# EAGLE design schaltplan_matrix2 (EAGLE 8.5.0)
blub
DRAWING_NAME: Matrix Schaltplan; LAST_DATE_TIME: 18.11.2013
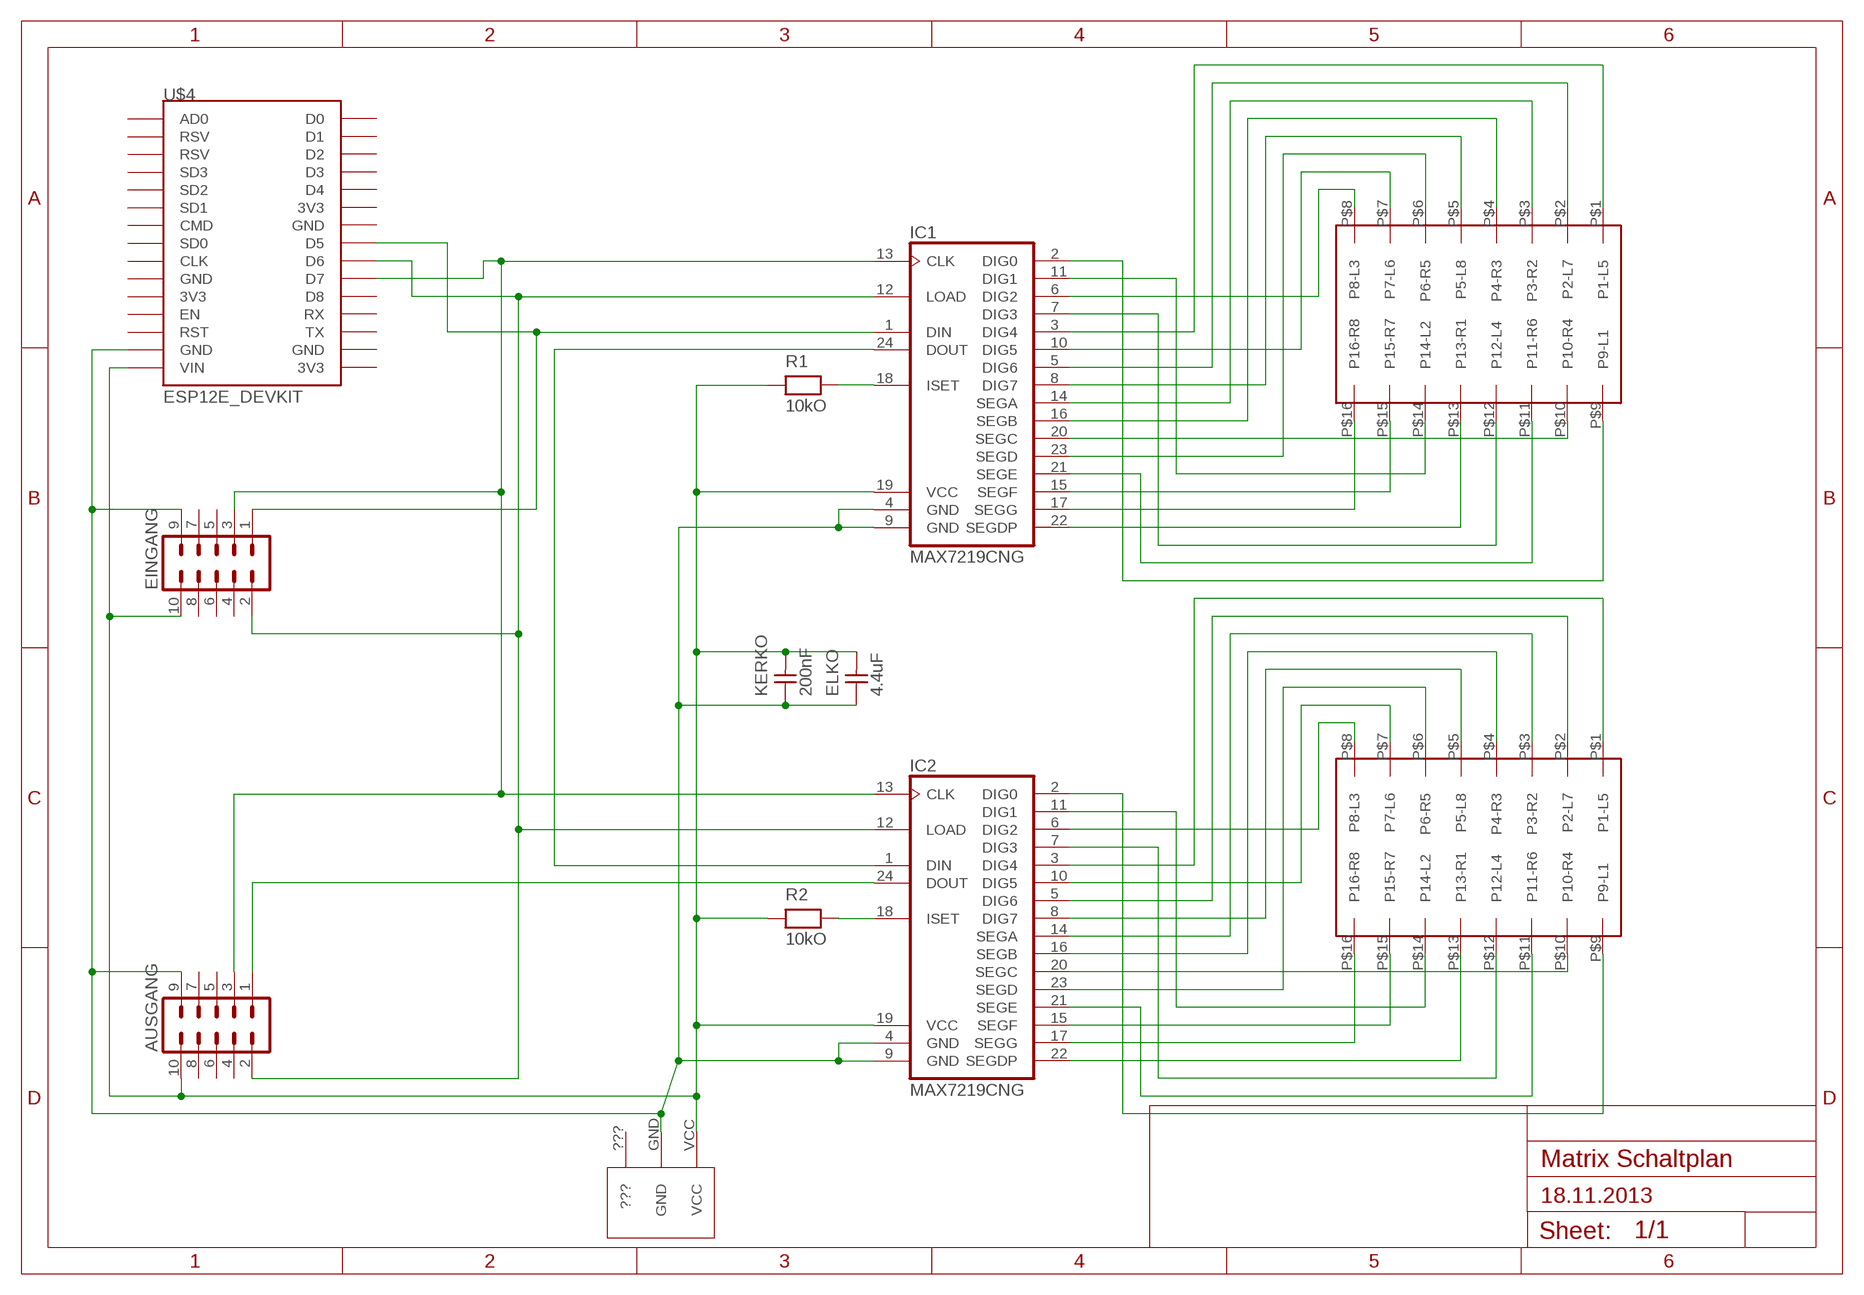
[diagram p0: schematic, sheet 1]

## Parts
AUSGANG  ML10  [ML10]
EINGANG  ML10  [ML10]
ELKO  4.4uF  CAPNP-5  [C-5]
IC1  MAX7219CNG  [DIL24-3]
IC2  MAX7219CNG  [DIL24-3]
KERKO  200nF  CAPNP-5  [C-5]
R1  10kO  RESEU-5  [R-5]
R2  10kO  RESEU-5  [R-5]
U$1  MATRIX  [MATRIX]
U$2  MATRIX  [MATRIX]
U$3  LUM1613-18  [LUM16113-18]
U$4  ESP12E_DEVKIT  [ESP12E_DEVKIT]

## Nets
N$1: IC1.20(SEGC) U$1.P$10(P10-R4)
N$2: IC1.21(SEGE) U$1.P$11(P11-R6)
N$3: IC2.22(SEGDP) U$2.P$13(P13-R1)
N$4: IC2.14(SEGA) U$2.P$3(P3-R2)
N$5: IC2.16(SEGB) U$2.P$4(P4-R3)
N$6: IC2.23(SEGD) U$2.P$6(P6-R5)
N$7: IC1.11(DIG1) U$1.P$14(P14-L2)
N$8: IC2.15(SEGF) U$2.P$15(P15-R7)
N$9: IC1.22(SEGDP) U$1.P$13(P13-R1)
N$10: IC1.6(DIG2) U$1.P$8(P8-L3)
N$11: IC1.7(DIG3) U$1.P$12(P12-L4)
N$12: IC1.14(SEGA) U$1.P$3(P3-R2)
N$13: IC1.16(SEGB) U$1.P$4(P4-R3)
N$14: IC1.2(DIG0) U$1.P$9(P9-L1)
N$15: IC1.23(SEGD) U$1.P$6(P6-R5)
N$16: IC2.17(SEGG) U$2.P$16(P16-R8)
N$17: IC1.15(SEGF) U$1.P$15(P15-R7)
N$18: IC1.17(SEGG) U$1.P$16(P16-R8)
N$19: IC1.3(DIG4) U$1.P$1(P1-L5)
N$20: IC1.10(DIG5) U$1.P$7(P7-L6)
N$21: IC2.11(DIG1) U$2.P$14(P14-L2)
N$22: IC1.5(DIG6) U$1.P$2(P2-L7)
N$23: IC1.8(DIG7) U$1.P$5(P5-L8)
N$24: IC2.6(DIG2) U$2.P$8(P8-L3)
N$25: IC2.7(DIG3) U$2.P$12(P12-L4)
N$26: IC2.3(DIG4) U$2.P$1(P1-L5)
N$27: IC2.10(DIG5) U$2.P$7(P7-L6)
N$28: IC2.5(DIG6) U$2.P$2(P2-L7)
N$29: IC2.8(DIG7) U$2.P$5(P5-L8)
N$30: IC2.21(SEGE) U$2.P$11(P11-R6)
N$31: IC2.20(SEGC) U$2.P$10(P10-R4)
N$32: IC2.2(DIG0) U$2.P$9(P9-L1)
N$33: EINGANG.1 IC1.1(DIN) U$4.D5
N$34: AUSGANG.3 EINGANG.3 IC1.13(CLK) IC2.13(CLK) U$4.D7
N$35: IC1.24(DOUT) IC2.1(DIN)
N$36: AUSGANG.2 EINGANG.2 IC1.12(LOAD) IC2.12(LOAD) U$4.D6
N$37 [power]: IC1.18(ISET) R1.2
N$38 [power]: IC2.18(ISET) R2.2
N$39: AUSGANG.10 EINGANG.10 ELKO.2 IC1.19(VCC) IC2.19(VCC) KERKO.2 R1.1 R2.1 U$3.VCC U$4.VIN
N$42: AUSGANG.1 IC2.24(DOUT)
N$43: AUSGANG.9 EINGANG.9 ELKO.1 IC1.4(GND) IC1.9(GND) IC2.4(GND) IC2.9(GND) KERKO.1 U$3.GND U$4.GND@1(GND)
Unconnected: AUSGANG.4 AUSGANG.5 AUSGANG.6 AUSGANG.7 AUSGANG.8 EINGANG.4 EINGANG.5 EINGANG.6 EINGANG.7 EINGANG.8 U$4.3V3@0(3V3) U$4.3V3@1(3V3) U$4.3V3@2(3V3) U$4.AD0 U$4.CLK U$4.CMD U$4.D0 U$4.D1 U$4.D2 U$4.D3 U$4.D4 U$4.D8 U$4.EN U$4.GND@0(GND) U$4.GND@2(GND) U$4.GND@3(GND) U$4.RST U$4.RSV@0(RSV) U$4.RSV@1(RSV) U$4.RX U$4.SD0 U$4.SD1 U$4.SD2 U$4.SD3 U$4.TX

## Power pins joined to a net without a drawn wire
???: U$3.???

## Library data of the parts
AUSGANG EINGANG = con-harting-ml:ML10: HARTING; OC_FARNELL: unknown; OC_NEWARK: unknown
ELKO KERKO = discrete-standart:CAPNP-5
IC1 IC2 = maxim:MAX7219CNG: LED DISPLAY DRIVER; MF: MAXIM; MPN: MAX7219CNG; OC_FARNELL: 1523914; OC_NEWARK: 34C4018
R1 R2 = discrete-standart:RESEU-5
U$1 U$2 = matrix:MATRIX: Erstellt von Sören Timm
U$3 = Eagle_Library:LUM1613-18
U$4 = ESP12E_DEVKIT:ESP12E_DEVKIT: ESP12E DEVKIT BOARD

## Net classes
0 default: width 0.406 mm, clearance 0.66 mm
1 power: width 0.61 mm, clearance 0.66 mm

## Board
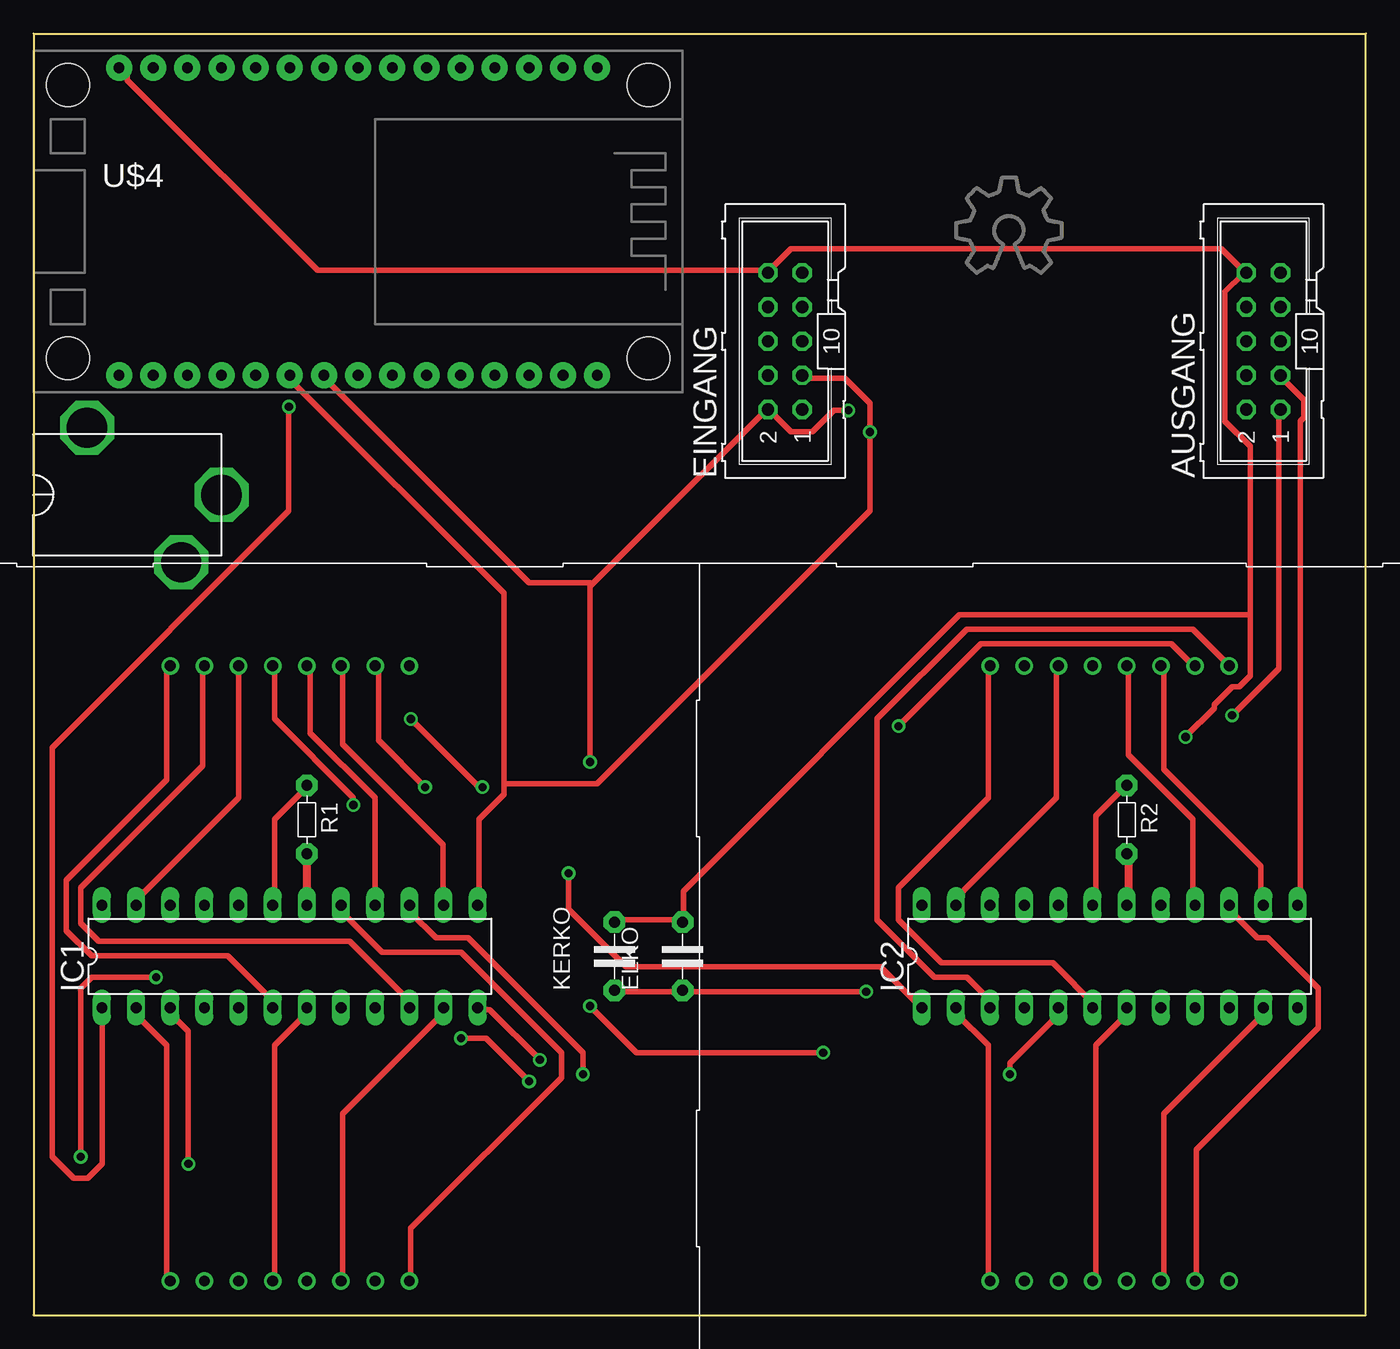
[diagram p1: board, top side]
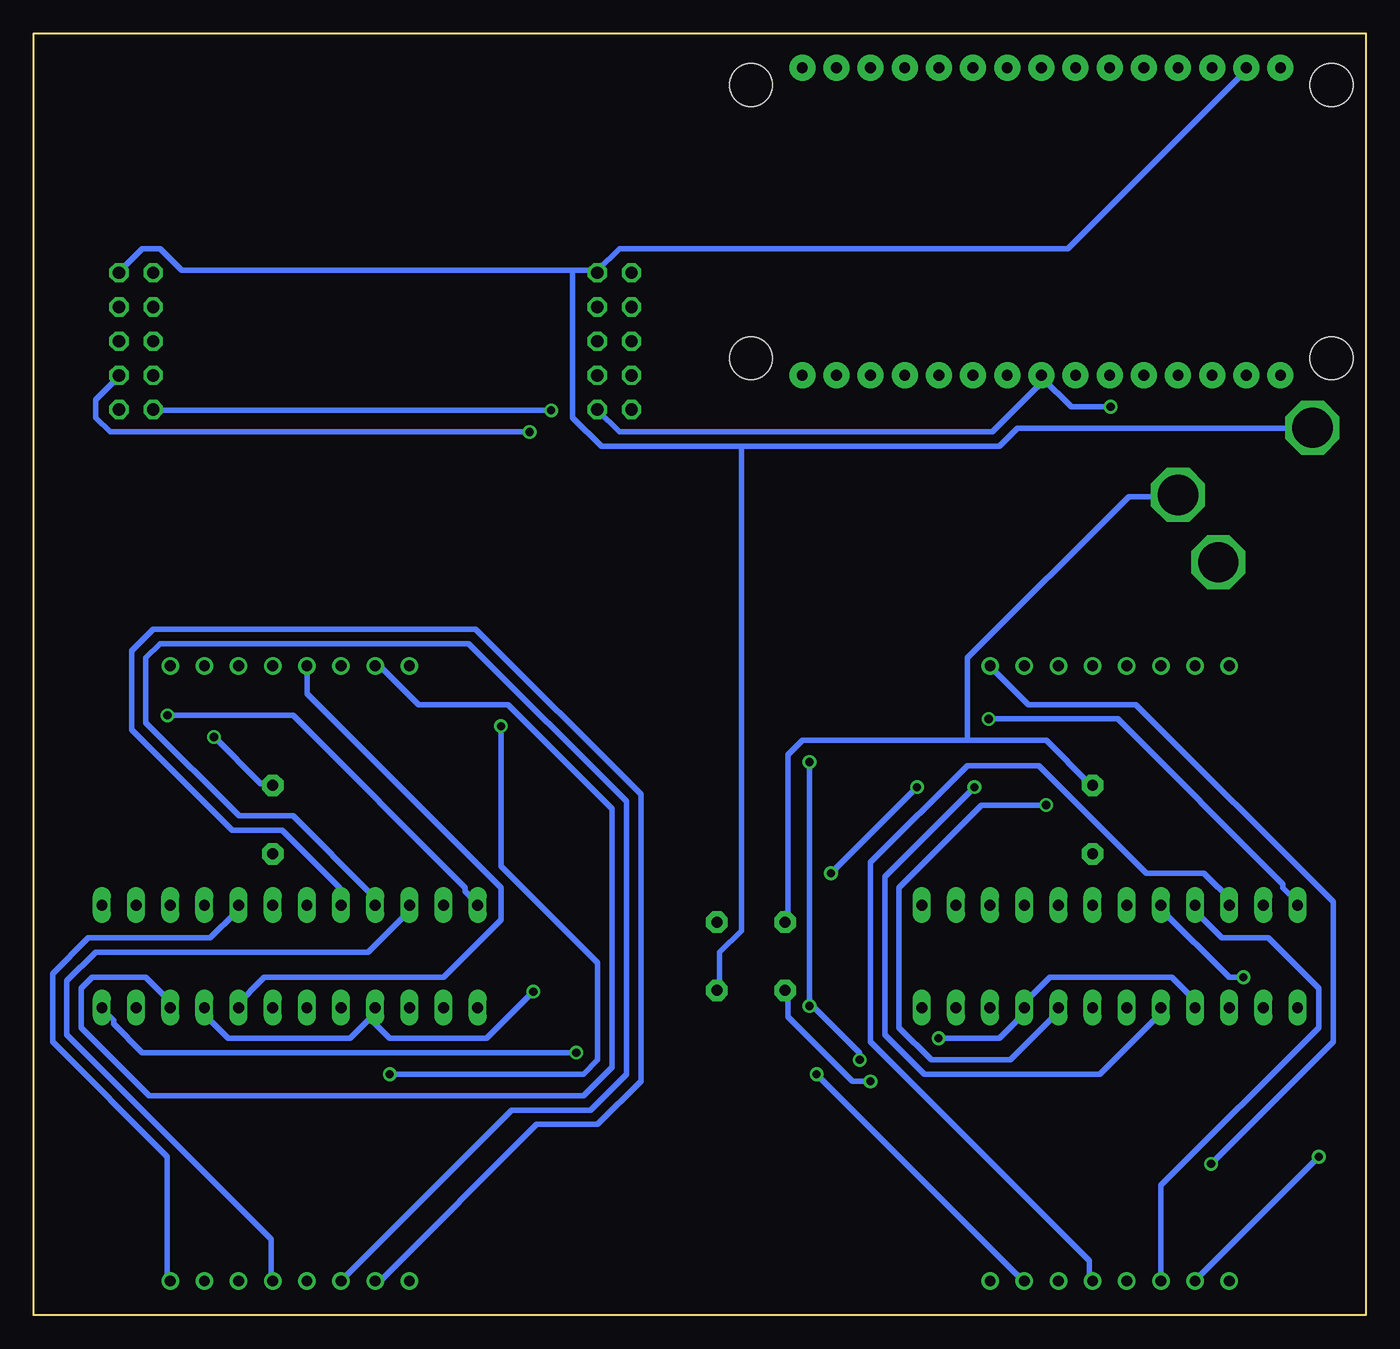
[diagram p2: board, bottom side, seen from below]

Size 99.06 x 95.25 mm. Coordinates in mm from the lower left corner, seen from the top.
Outline: 0,0 99.06,0 99.06,95.25 0,95.25 0,0
Copper layers (1*16): Top 0.035mm / dielectric 1.5mm / Bottom 0.035mm
Design rules "default": minimum track width 10mil, minimum drill 24mil, track to track 8mil, track to pad 8mil, pad to pad 8mil, via to via 8mil, smd to smd 8mil, copper to edge 40mil, drill to drill 8mil, minimum pad ring 10mil, minimum via ring 8mil, stop-mask expansion 4mil, vias tented up to drill 0mil, thermal gap 10mil

### Footprints (pad centres in the part's own frame; a part is rotated, then mirrored left to right if it is on the bottom)
ML10 = drill 0.914 octagon: 1 -5.08,-1.27; 2 -5.08,1.27; 3 -2.54,-1.27; 4 -2.54,1.27; 5 0,-1.27; 6 0,1.27; 7 2.54,-1.27; 8 2.54,1.27; 9 5.08,-1.27; 10 5.08,1.27
C-5 = drill 0.813 pad 1.6 octagon: 1 -2.54,0; 2 2.54,0
DIL24-3 = drill 0.813 long: 1 -13.97,-3.81; 2 -11.43,-3.81; 3 -8.89,-3.81; 4 -6.35,-3.81; 5 -3.81,-3.81; 6 -1.27,-3.81; 7 1.27,-3.81; 8 3.81,-3.81; 9 6.35,-3.81; 10 8.89,-3.81; 11 11.43,-3.81; 12 13.97,-3.81; 13 13.97,3.81; 14 11.43,3.81; 15 8.89,3.81; 16 6.35,3.81; 17 3.81,3.81; 18 1.27,3.81; 19 -1.27,3.81; 20 -3.81,3.81; 21 -6.35,3.81; 22 -8.89,3.81; 23 -11.43,3.81; 24 -13.97,3.81
R-5 = drill 0.813 pad 1.6 octagon: 1 -2.54,0; 2 2.54,0
MATRIX = drill 0.8: P$1 21.59,-53.34; P$2 24.13,-53.34; P$3 26.67,-53.34; P$4 29.21,-53.34; P$5 31.75,-53.34; P$6 34.29,-53.34; P$7 36.83,-53.34; P$8 39.37,-53.34; P$9 39.37,-7.62; P$10 36.83,-7.62; P$11 34.29,-7.62; P$12 31.75,-7.62; P$13 29.21,-7.62; P$14 26.67,-7.62; P$15 24.13,-7.62; P$16 21.59,-7.62
LUM16113-18 = drill 3 octagon: ??? 5,-3; GND -5,-10; VCC 0,0
ESP12E_DEVKIT = drill 0.8 pad 1.93: 3V3@0 -11.43,-7.62; 3V3@1 11.43,5.08; 3V3@2 11.43,-17.78; AD0 -11.43,17.78; CLK -11.43,-2.54; CMD -11.43,2.54; D0 11.43,17.78; D1 11.43,15.24; D2 11.43,12.7; D3 11.43,10.16; D4 11.43,7.62; D5 11.43,0; D6 11.43,-2.54; D7 11.43,-5.08; D8 11.43,-7.62; EN -11.43,-10.16; GND@0 -11.43,-5.08; GND@1 -11.43,-15.24; GND@2 11.43,2.54; GND@3 11.43,-15.24; RST -11.43,-12.7; RSV@0 -11.43,15.24; RSV@1 -11.43,12.7; RX 11.43,-10.16; SD0 -11.43,0; SD1 -11.43,5.08; SD2 -11.43,7.62; SD3 -11.43,10.16; TX 11.43,-12.7; VIN -11.43,-17.78 | hole 3.2: -10.16,21.59; 10.16,21.59; 10.16,-21.59; -10.16,-21.59

### Placement (x,y rotation side)
AUSGANG  91.44,72.39 90 top
EINGANG  55.88,72.39 90 top
ELKO  48.26,26.67 90 top
IC1  19.05,26.67 0 top
IC2  80.01,26.67 0 top
KERKO  43.18,26.67 90 top
R1  20.32,36.83 270 top
R2  81.28,36.83 270 top
U$1  49.53,-5.08 180 top
U$2  110.49,-5.08 180 top
U$3  13.97,60.96 270 top
U$4  24.13,81.28 270 top

### Tracks (layer width: path | path; a pad name or v marks a point on that pad's centre or on a via)
N$1  (via drill 0.61)
  Top 0.406: v3.5,11.77 3.5,24.31 4.3,25.11 v9.11,25.11
  Bottom 0.406: v3.5,11.77 12.57,2.71 U$1.P$10 | v9.11,25.11 10.17,25.11 15.24,30.17 IC1.20
N$2
  Bottom 0.406: U$1.P$11 15.24,9.64 3.5,21.37 3.5,24.31 7.24,28.04 10.71,28.04 12.57,29.91 12.57,30.44 IC1.21
N$3
  Bottom 0.406: U$2.P$13 81.38,2.71 81.38,5.64 96.58,20.84 96.58,24.84 94.45,26.98 74.18,26.98 71.25,29.91 71.25,30.44 IC2.22
N$4
  Top 0.406: U$2.P$3 84.05,48.04 84.05,40.58 91.25,33.38 91.25,30.71 IC2.14
N$5
  Top 0.406: U$2.P$4 81.38,48.04 81.38,41.64 86.18,36.84 86.18,30.71 IC2.16
N$6
  Top 0.406: IC2.23 68.58,30.98 76.05,38.44 76.05,48.04 U$2.P$6
N$7
  Top 0.406: U$1.P$14 22.97,2.71 22.97,14.97 30.71,22.71 IC1.11
N$8
  Top 0.406: U$2.P$15 86.45,2.71 86.45,12.31 95.52,21.37 95.52,24.31 91.78,28.04 90.98,28.04 89.12,29.91 89.12,30.44 IC2.15
N$9
  Bottom 0.406: U$1.P$13 20.57,2.71 20.57,4.04 36.84,20.31 36.84,33.64 29.64,40.84 24.31,40.84 16.31,32.84 12.04,32.84 9.91,30.71 IC1.22
N$10
  Top 0.406: U$1.P$8 9.91,48.04 9.91,39.78 2.44,32.31 2.44,28.58 4.3,26.71 14.44,26.71 17.64,23.51 17.64,22.97 IC1.6
N$11
  Top 0.406: U$1.P$12 17.91,2.71 17.91,20.04 20.57,22.71 IC1.7
N$12
  Top 0.406: U$1.P$3 22.97,48.04 22.97,42.44 30.44,34.98 30.44,30.71 IC1.14
N$13
  Top 0.406: U$1.P$4 20.57,48.04 20.57,43.24 25.37,38.44 25.37,30.71 IC1.16
N$14
  Top 0.406: U$1.P$9 9.91,2.71 9.91,20.04 7.77,22.17 7.77,22.71 IC1.2
N$15
  Top 0.406: U$1.P$6 15.24,38.44 7.51,30.71 IC1.23
N$16
  Bottom 0.406: U$2.P$16 89.12,2.71 89.12,11.77 97.65,20.31 97.65,25.38 94.98,28.04 85.91,28.04 84.05,29.91 84.05,30.44 IC2.17
N$17  (via drill 0.61)
  Top 0.406: v40.84,17.91 40.84,19.51 32.31,28.04 29.91,28.04 28.04,29.91 28.04,30.44 IC1.15
  Bottom 0.406: v40.84,17.91 25.64,2.71 U$1.P$15
N$18
  Top 0.406: U$1.P$16 28.04,2.71 28.04,6.44 39.24,17.64 39.24,19.51 31.77,26.98 25.91,26.98 22.97,29.91 22.97,30.44 IC1.17
N$19  (via drill 0.61)
  Top 0.406: v11.51,11.24 11.51,21.11 9.91,22.71 IC1.3
  Bottom 0.406: v11.51,11.24 2.44,20.31 2.44,30.71 17.11,45.38 25.11,45.38 27.77,48.04 U$1.P$1
N$20
  Top 0.406: U$1.P$7 12.57,48.04 12.57,40.84 3.5,31.77 3.5,29.11 4.84,27.77 23.51,27.77 27.77,23.51 27.77,22.97 IC1.10
N$21
  Top 0.406: U$2.P$14 84.05,2.71 84.05,14.97 91.25,22.17 91.25,22.71 IC2.11
N$22  (via drill 0.61)
  Top 0.406: v29.11,39.24 25.64,42.71 25.64,48.04 U$1.P$2
  Bottom 0.406: v29.11,39.24 35.78,32.58 35.78,20.84 32.84,17.91 19.77,17.91 15.24,22.44 IC1.5
N$23  (via drill 0.61)
  Top 0.406: v23.77,37.91 23.77,38.44 17.91,44.31 17.91,48.04 U$1.P$5
  Bottom 0.406: v23.77,37.91 28.57,37.91 34.71,31.77 34.71,21.37 32.31,18.97 26.44,18.97 22.71,22.71 IC1.8
N$24
  Top 0.406: U$2.P$8 70.98,48.04 70.98,38.44 64.31,31.77 64.31,29.38 67.51,26.17 75.78,26.17 78.98,22.97 IC2.6
N$25
  Top 0.406: U$2.P$12 78.98,2.71 78.98,20.04 81.11,22.17 81.11,22.71 IC2.7
N$26
  Top 0.406: U$2.P$1 86.18,50.98 69.38,50.98 62.71,44.31 62.71,29.38 66.98,25.11 69.38,25.11 70.98,23.51 70.98,22.97 IC2.3
N$27
  Bottom 0.406: U$2.P$7 73.65,48.04 73.11,48.04 70.45,45.38 63.78,45.38 56.04,37.64 56.04,18.44 58.18,16.31 90.45,16.31 95.52,21.37 95.52,24.31 94.72,25.11 90.72,25.11 89.12,23.51 89.12,22.97 IC2.10
N$28  (via drill 0.61)
  Top 0.406: v64.31,43.78 70.45,49.91 84.58,49.91 86.18,48.31 U$2.P$2 | v72.58,17.91 72.58,18.71 76.05,22.17 76.05,22.71 IC2.5
  Bottom 0.406: v64.31,43.78 64.31,33.38 57.11,26.17 57.11,18.97 58.18,17.91 v72.58,17.91
N$29
  Bottom 0.406: U$2.P$5 78.72,48.04 78.72,46.18 64.31,31.77 64.31,29.38 68.58,25.11 81.91,25.11 84.05,22.97 IC2.8
N$30
  Bottom 0.406: U$2.P$11 76.05,2.71 63.51,15.24 57.64,15.24 54.98,17.91 54.98,38.18 66.71,49.91 89.65,49.91 90.72,48.84 90.72,44.04 83.78,37.11 79.78,37.11 73.91,31.24 73.91,30.71 IC2.21
N$31
  Bottom 0.406: U$2.P$10 73.65,2.71 73.11,2.71 61.65,14.17 57.11,14.17 53.91,17.37 53.91,38.71 66.18,50.98 90.18,50.98 91.78,49.38 91.78,43.51 84.31,36.04 80.58,36.04 76.31,31.77 76.31,30.71 IC2.20
N$32
  Top 0.406: IC2.2 68.58,22.44 70.98,20.04 70.98,2.71 U$2.P$9
N$33  (via drill 0.61)
  Top 0.406: v18.97,67.51 18.97,59.78 1.37,42.18 1.37,11.77 2.97,10.17 4.04,10.17 5.1,11.24 5.1,22.71 IC1.1
  Bottom 0.406: v18.97,67.51 21.91,67.51 24.04,69.65 U$4.D5 24.04,69.38 27.77,65.65 55.51,65.65 57.11,67.25 EINGANG.1
N$34  (via drill 0.61)
  Top 0.406: IC2.13 94.18,30.71 94.18,66.45 94.45,66.71 94.45,68.05 92.85,69.65 AUSGANG.3 | 34.98,39.51 34.98,53.65 18.97,69.65 U$4.D7 | 34.98,39.51 34.98,38.71 33.11,36.84 33.11,30.71 IC1.13 | 34.98,39.51 41.91,39.51 62.18,59.78 v62.18,65.65 62.18,67.78 60.31,69.65 57.38,69.65 EINGANG.3
  Bottom 0.406: v62.18,65.65 93.38,65.65 94.45,66.71 94.45,68.05 92.85,69.65 AUSGANG.3
N$35  (via drill 0.61)
  Top 0.406: v28.04,44.31 33.11,39.24 v33.38,39.24 | v39.78,32.84 39.78,30.17 44.04,25.91 62.98,25.91 65.91,22.97 IC2.1
  Bottom 0.406: v28.04,44.31 18.44,44.31 6.17,32.04 6.17,31.77 5.1,30.71 IC1.24 | v39.78,32.84 v33.38,39.24
N$36  (via drill 0.61)
  Top 0.406: v37.64,18.97 33.91,22.71 33.11,22.71 IC1.12 | v41.38,41.11 41.38,54.18 41.51,54.31 | 41.51,54.31 54.44,67.25 EINGANG.2 54.71,67.25 56.31,65.65 57.91,65.65 59.51,67.25 v60.58,67.25 | v58.71,19.51 44.84,19.51 v41.38,22.97 | U$4.D6 21.64,69.65 36.84,54.45 41.38,54.45 41.51,54.31
  Bottom 0.406: v37.64,18.97 37.64,19.51 41.24,23.11 | 41.24,23.11 41.38,23.24 v41.38,41.11 | v58.71,19.51 90.98,19.51 93.12,21.64 93.12,21.91 93.92,22.71 IC2.12 | v41.38,22.97 41.24,23.11 | v60.58,67.25 89.92,67.25 AUSGANG.2
N$37
  Top 0.61: IC1.18 20.31,30.71 20.31,34.18 R1.2
N$38
  Top 0.61: IC2.18 81.38,30.71 81.38,34.18 R2.2
N$39  (via drill 0.61)
  Top 0.406: KERKO.2 43.24,29.38 48.04,29.38 ELKO.2 48.31,29.38 48.31,31.51 68.85,52.05 90.45,52.05 | IC1.19 17.91,30.71 17.91,36.84 20.31,39.24 R1.1 | IC2.19 78.98,30.71 78.98,37.11 81.11,39.24 R2.1 | U$4.VIN 6.44,92.58 6.97,92.05 6.97,91.78 21.11,77.65 54.44,77.65 EINGANG.10 54.71,77.65 56.31,79.25 88.32,79.25 89.92,77.65 AUSGANG.10 89.92,77.38 88.58,76.05 88.58,66.45 90.45,64.58 90.45,52.05 | v85.65,42.98 87.78,45.11 87.78,45.38 89.12,46.71 89.65,46.71 90.45,47.51 90.45,52.05
  Bottom 0.406: 29.64,42.71 23.77,42.71 20.57,39.51 R1.1 | 29.64,42.71 41.91,42.71 42.98,41.64 42.98,29.38 KERKO.2 | 29.64,42.71 29.64,48.84 17.64,60.85 14.17,60.85 U$3.VCC | v85.65,42.98 82.18,39.51 81.38,39.51 R2.1
N$42  (via drill 0.61)
  Top 0.406: v89.12,44.58 92.58,48.04 92.58,67.25 AUSGANG.1
  Bottom 0.406: v89.12,44.58 79.78,44.58 66.98,31.77 66.98,31.51 66.18,30.71 IC2.24
N$43  (via drill 0.61)
  Top 0.406: KERKO.1 43.24,24.04 48.04,24.04 ELKO.1 48.31,24.04 v61.91,24.04 | v31.77,20.57 33.64,20.57 v36.84,17.37
  Bottom 0.406: IC1.4 12.84,22.97 12.84,23.51 14.44,25.11 23.51,25.11 25.64,22.97 IC1.9 25.64,22.71 25.64,22.17 27.24,20.57 v31.77,20.57 | IC2.9 86.18,22.71 86.18,22.17 84.58,20.57 75.51,20.57 73.91,22.17 73.91,22.71 IC2.4 73.91,21.91 72.58,20.57 65.38,20.57 v61.91,24.04 | v36.84,17.37 38.18,17.37 42.98,22.17 42.98,24.04 KERKO.1 | 58.98,77.65 88.05,77.65 89.65,79.25 90.98,79.25 92.58,77.65 AUSGANG.9 | 58.98,77.65 57.38,77.65 EINGANG.9 57.11,77.65 55.51,79.25 22.17,79.25 9.11,92.32 9.11,92.58 U$4.GND@1 | 46.44,64.58 56.84,64.58 58.98,66.71 58.98,77.65 | 46.44,64.58 27.24,64.58 25.91,65.91 4.04,65.91 U$3.GND | 46.44,64.58 46.44,28.58 48.04,26.98 48.04,24.31 ELKO.1

### Text on the board
Document: LED Matrix Project / Florian Lüdiger / January 2018